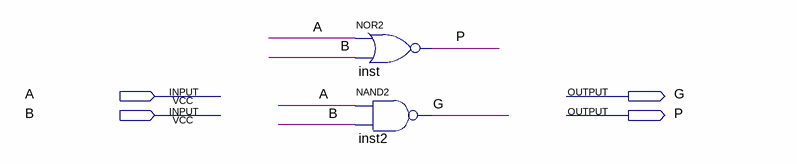
[diagram p0: schematic sheet]
// Quartus schematic CLAauxbdf.bdf as structural Verilog: 2 symbols, 4 pins
module CLAauxbdf (
  input  A,
  input  B,
  output G,
  output P
);

  nor inst (P, A, B);
  nand inst2 (G, A, B);
endmodule
